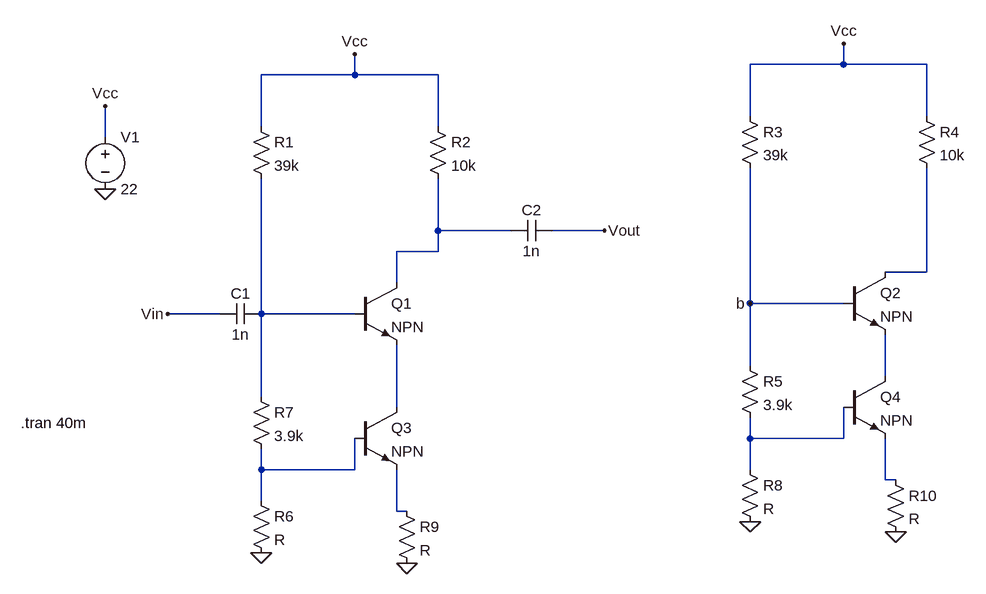
[diagram p0: schematic Draft62.asc]
Draft62.asc, the LTspice schematic file:
Version 4
SHEET 1 880 680
WIRE 592 -256 592 -288
WIRE 592 -256 448 -256
WIRE 720 -256 592 -256
WIRE -160 -240 -160 -272
WIRE -160 -240 -304 -240
WIRE -32 -240 -160 -240
WIRE 448 -176 448 -256
WIRE 720 -176 720 -256
WIRE -304 -160 -304 -240
WIRE -32 -160 -32 -240
WIRE -544 -144 -544 -192
WIRE -32 0 -32 -80
WIRE 80 0 -32 0
WIRE 224 0 144 0
WIRE -32 32 -32 0
WIRE -32 32 -96 32
WIRE 720 64 720 -96
WIRE 720 64 656 64
WIRE -96 80 -96 32
WIRE 448 112 448 -96
WIRE 592 112 448 112
WIRE -368 128 -448 128
WIRE -304 128 -304 -80
WIRE -160 128 -304 128
WIRE 448 208 448 112
WIRE 656 224 656 160
WIRE -304 256 -304 128
WIRE -96 272 -96 176
WIRE 448 320 448 288
WIRE 592 320 592 272
WIRE 592 320 448 320
WIRE -304 368 -304 336
WIRE -160 368 -160 320
WIRE -160 368 -304 368
WIRE 448 368 448 320
WIRE 656 384 656 320
WIRE 672 384 656 384
WIRE -304 416 -304 368
WIRE -96 432 -96 368
WIRE -80 432 -96 432
FLAG -544 -64 0
FLAG -448 128 Vin
FLAG 224 0 Vout
FLAG -160 -272 Vcc
FLAG -544 -192 Vcc
FLAG 592 -288 Vcc
FLAG 448 112 b
FLAG -80 512 0
FLAG -304 496 0
FLAG 672 464 0
FLAG 448 448 0
SYMBOL res -320 -176 R0
SYMATTR InstName R1
SYMATTR Value 39k
SYMBOL res -48 -176 R0
SYMATTR InstName R2
SYMATTR Value 10k
SYMBOL voltage -544 -160 R0
WINDOW 123 0 0 Left 0
WINDOW 39 0 0 Left 0
SYMATTR InstName V1
SYMATTR Value 22
SYMBOL cap -304 112 R90
WINDOW 0 0 32 VBottom 2
WINDOW 3 32 32 VTop 2
SYMATTR InstName C1
SYMATTR Value 1n
SYMBOL cap 144 -16 R90
WINDOW 0 0 32 VBottom 2
WINDOW 3 32 32 VTop 2
SYMATTR InstName C2
SYMATTR Value 1n
SYMBOL npn -160 80 R0
SYMATTR InstName Q1
SYMBOL res 432 -192 R0
SYMATTR InstName R3
SYMATTR Value 39k
SYMBOL res 704 -192 R0
SYMATTR InstName R4
SYMATTR Value 10k
SYMBOL npn 592 64 R0
SYMATTR InstName Q2
SYMBOL res -320 240 R0
SYMATTR InstName R7
SYMATTR Value 3.9k
SYMBOL npn -160 272 R0
SYMATTR InstName Q3
SYMBOL res -320 400 R0
SYMATTR InstName R6
SYMBOL res -96 416 R0
SYMATTR InstName R9
SYMBOL res 432 192 R0
SYMATTR InstName R5
SYMATTR Value 3.9k
SYMBOL res 432 352 R0
SYMATTR InstName R8
SYMBOL res 656 368 R0
SYMATTR InstName R10
SYMBOL npn 592 224 R0
SYMATTR InstName Q4
TEXT -674 296 Left 2 !.tran 40m

The netlist it stands for:
* Draft62.asc
R1 Vcc N003 39k
R2 Vcc N001 10k
V1 Vcc 0 22
C1 N003 Vin 1n
C2 Vout N001 1n
Q1 N001 N003 N005 0 NPN
R3 Vcc b 39k
R4 Vcc N002 10k
Q2 N002 b N004 0 NPN
R7 N003 N007 3.9k
Q3 N005 N007 N009 0 NPN
R6 N007 0 R
R9 N009 0 R
R5 b N006 3.9k
R8 N006 0 R
R10 N008 0 R
Q4 N004 N006 N008 0 NPN
.model NPN NPN
.model PNP PNP
.lib standard.bjt
.tran 40m
.backanno
.end